# Altium schematic sheet RS232-RS485-PC.SchDoc
size A
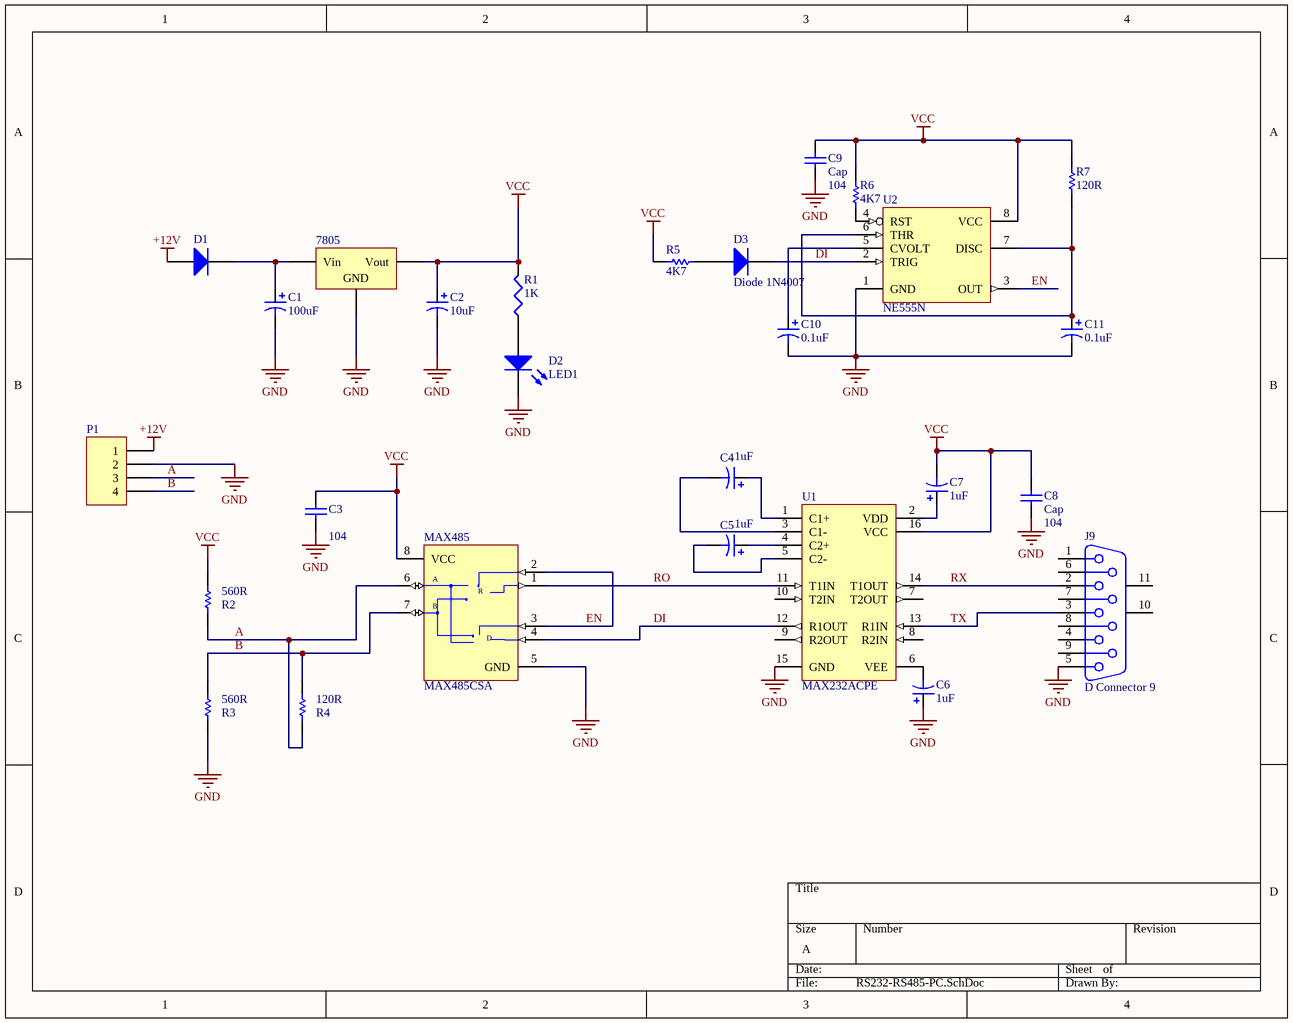
[diagram p0: RS232-RS485-PC.SchDoc]

## Parts
7805  Volt Reg  [78xx_NO]  (value not drawn)
C1  value 100uF  [tu 100uF/50v]  (hidden comment: Cap Pol1)
C2  value 10uF  [tu 10uF]  (hidden comment: Cap Pol1)
C3  value 104  [C104_YELLOW]  (hidden comment: Cap)
C4  value 1uF  [tu 10uF]  (hidden comment: Cap Pol1)
C5  value 1uF  [tu 10uF]  (hidden comment: Cap Pol1)
C6  value 1uF  [tu 10uF]  (hidden comment: Cap Pol1)
C7  value 1uF  [tu 10uF]  (hidden comment: Cap Pol1)
C8  Cap  value 104  [C104_YELLOW]
C9  Cap  value 104  [C104_YELLOW]
C10  value 0.1uF  [C104_YELLOW]  (hidden comment: Cap Pol1)
C11  value 0.1uF  [C104_YELLOW]  (hidden comment: Cap Pol1)
D1  Diode 1N4007  [D_2A]  (value not drawn)
D2  LED1  [LED_3]
D3  Diode 1N4007  [D_1A]
J9  D Connector 9  [COM9_2]
MAX485  MAX485CSA  [PA8]
P1  Header 4  [Header4]  (value not drawn)
R1  value 1K  [R_Nor]  (hidden comment: Res3)
R2  560R  [R_Nor]
R3  560R  [R_Nor]
R4  120R  [R_Nor]
R5  4K7  [R_Nor]
R6  4K7  [R_Nor]
R7  120R  [R_Nor]
U1  MAX232ACPE  [PE16A]
U2  NE555N  [DIP8]

## Nets
+12V: D1.1(A) P1.1
GND: 7805.2(GND) C1.2 C2.2 C3.1 C6.1 C8.1 C9.1 C10.2 C11.2 D2.2(K) J9.5 MAX485.5(GND) P1.2 R3.1 U1.15(GND) U2.1(GND)
VCC: 7805.3(Vout) C2.1 C3.2 C7.2 C8.2 C9.2 MAX485.8(VCC) R1.2 R2.2 R5.2 R6.1 R7.1 U1.16(VCC) U2.8(VCC)
A: MAX485.6(A) P1.3 R2.1 R4.1
B: MAX485.7(B) P1.4 R3.2 R4.2
DI: D3.2(K) MAX485.4(DI) U1.12(R1OUT) U2.2(TRIG)
EN: MAX485.2(~{RE}) MAX485.3(DE) U2.3(OUT)
RO: MAX485.1(RO) U1.11(T1IN)
RX: J9.2 U1.14(T1OUT)
TX: J9.3 U1.13(R1IN)
Net7805_1: 7805.1(Vin) C1.1 D1.2(K)
NetC4_1: C4.1 U1.1(C1+)
NetC4_2: C4.2 U1.3(C1-)
NetC5_1: C5.1 U1.4(C2+)
NetC5_2: C5.2 U1.5(C2-)
NetC6_2: C6.2 U1.6(VEE)
NetC7_1: C7.1 U1.2(VDD)
NetC10_1: C10.1 U2.5(CVOLT)
NetC11_1: C11.1 R7.2 U2.6(THR) U2.7(DISC)
NetD2_1: D2.1(A) R1.1
NetD3_1: D3.1(A) R5.1
NetR6_2: R6.2 U2.4(RST)

Not connected (* = marked no-connect by the designer): J9 1 4 6 7 8 9 10(MH1) 11(MH2); U1 7(T2OUT) 8(R2IN) 9(R2OUT) 10(T2IN)

## Notes on the sheet
- (in symbol MAX485CSA) R; D

## Library data of the parts
7805 = Volt Reg: Voltage Regulator; Published: 24-Mar-1999; LatestRevisionDate: 29-May-2009; LatestRevisionNote: IPC-7351 Footprint Added.; PackageReference: D2PAK; Publisher: Altium Limited; PackageDescription: 3-Pin Transistor Outline Package 2.54 mm Pitch, 15.1 mm Lead Span
C1 C2 C4-C7 C10 C11 = Cap Pol1: Polarized Capacitor (Radial); Published: 8-Jun-2000; LatestRevisionDate: 17-Jul-2002; LatestRevisionNote: Re-released for DXP Platform.; PackageReference: RB7.6-15; Publisher: Altium Limited
C3 C8 C9 = Ceramic: Capcitor
D1 D3 = Diode 1N4007: 1 Amp General Purpose Rectifier; Published: 8-Jun-2000; LatestRevisionDate: 17-Jul-2002; LatestRevisionNote: Re-released for DXP Platform.; DatasheetVersion: 1998; PackageVersion: Aug-1999; PackageReference: DO-41; Publisher: Altium Limited; Code_JEDEC: DO-204-AL; ComponentLink1Description: Manufacturer Link; ComponentLink1URL: http://www.fairchildsemi.com/; ComponentLink2Description: Datasheet; ComponentLink2URL: http://www.fairchildsemi.com/ds/1N%2F1N4001.pdf
D2 = LED1: Typical RED GaAs LED; Published: 8-Jun-2000; LatestRevisionDate: 08-Jul-2005; LatestRevisionNote: Mech Layer 1 removed.; PackageReference: LED-1; Publisher: Altium Limited
J9 = D Connector 9: Receptacle Assembly, 9 Position, Right Angle; PackageDocument: O; Positions: 9; Published: 15-Jun-2001; LatestRevisionDate: 17-Jul-2002; LatestRevisionNote: Re-released for DXP Platform.; DatasheetDocument: 1-Sep-1999; PackageReference: 788750; Publisher: Altium Limited; Orientation: Right Angle; Gender: Receptacle
MAX485 = MAX485CSA: Low-Power, Slew-Rate-Limited RS-485/RS-422 Transceiver; Published: 16-Jan-2001; LatestRevisionDate: 13-Apr-2006; LatestRevisionNote: IPC-7351 Footprint Added.; DatasheetVersion: Feb-1996; PackageReference: NSO8; Publisher: Altium Limited; PackageDescription: 8-Pin Small Outline Integrated Circuit 1.27 mm Pitch; Code_JEDEC: MS-012-AA; Code_IPC: SOIC127P600-8; ComponentLink1Description: Manufacturer Link; ComponentLink1URL: http://www.maxim-ic.com/; ComponentLink2Description: Datasheet; ComponentLink2URL: http://pdfserv.maxim-ic.com/en/ds/MAX1487-MAX491.pdf
P1 = Header 4: Header, 4-Pin; LatestRevisionDate: 17-Jul-2002; LatestRevisionNote: Re-released for DXP Platform.; Publisher: Altium Limited
R1 = Res3: Resistor; Published: 8-Jun-2000; LatestRevisionDate: 04-Mar-2005; LatestRevisionNote: PCB Footprint replaced.; PackageReference: J1-0603; Publisher: Altium Limited
R2-R7 = Res
U1 = MAX232ACPE: +5V Powered, Multi-Channel RS-232 Driver/Receiver; Published: 16-Jan-2001; LatestRevisionDate: 29-May-2009; LatestRevisionNote: Component Body Added.; PackageVersion: 1997; PackageReference: PE16A; Publisher: Altium Limited; PackageDescription: DIP, 16-Pin, Row Spacing 7.62 mm, Pitch 2.54 mm; Code_JEDEC: MS-001-BB; ComponentLink1Description: Manufacturer Link; ComponentLink1URL: http://www.maxim-ic.com/; ComponentLink2Description: Datasheet; ComponentLink2URL: http://pdfserv.maxim-ic.com/en/ds/MAX220-MAX249.pdf
U2 = NE555N: General-Purpose Single Bipolar Timer; Published: 24-Aug-2001; LatestRevisionDate: 06-Jun-2005; LatestRevisionNote: Stylized 3D Model Added.; DatasheetVersion: Jul-1998; PackageReference: DIP8; Publisher: Altium Limited; PackageDescription: DIP; 8 Leads; Row Spacing 7.62 mm; Pitch 2.54 mm; Code_JEDEC: MO-001-AN; ComponentLink1Description: Manufacturer Link; ComponentLink1URL: http://www.st.com/; ComponentLink2Description: Datasheet; ComponentLink2URL: http://www.st.com/stonline/products/literature/ds/2182/ne555.pdf